# EAGLE design RPi0-HAT1 (EAGLE 9.6.2)
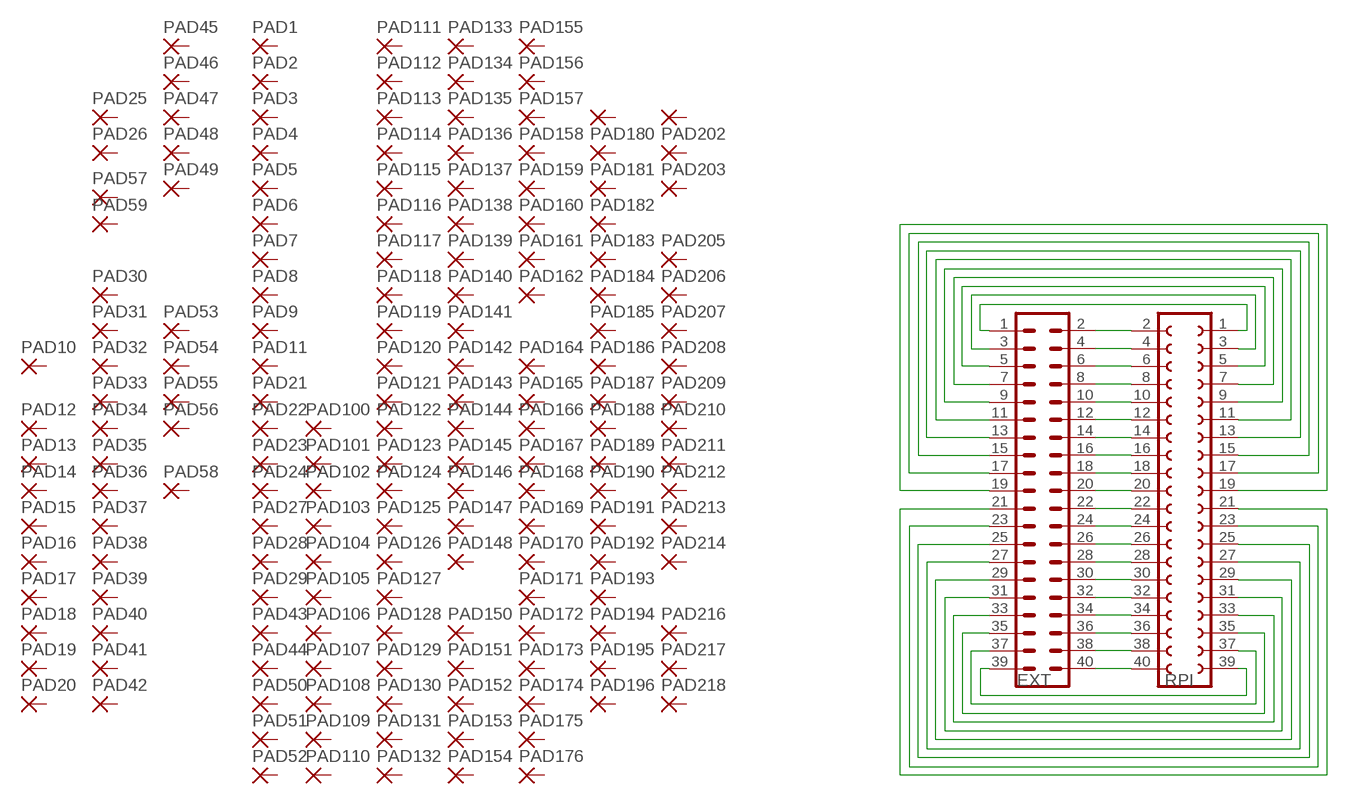
[diagram p0: schematic, sheet 1]

## Parts
EXT  MA20-2  [MA20-2]
PAD1  1,6/0,9  [1,6/0,9]
PAD2  1,6/0,9  [1,6/0,9]
PAD3  1,6/0,9  [1,6/0,9]
PAD4  1,6/0,9  [1,6/0,9]
PAD5  1,6/0,9  [1,6/0,9]
PAD6  1,6/0,9  [1,6/0,9]
PAD7  1,6/0,9  [1,6/0,9]
PAD8  1,6/0,9  [1,6/0,9]
PAD9  1,6/0,9  [1,6/0,9]
PAD10  1,6/0,9  [1,6/0,9]
PAD11  1,6/0,9  [1,6/0,9]
PAD12  1,6/0,9  [1,6/0,9]
PAD13  1,6/0,9  [1,6/0,9]
PAD14  1,6/0,9  [1,6/0,9]
PAD15  1,6/0,9  [1,6/0,9]
PAD16  1,6/0,9  [1,6/0,9]
PAD17  1,6/0,9  [1,6/0,9]
PAD18  1,6/0,9  [1,6/0,9]
PAD19  1,6/0,9  [1,6/0,9]
PAD20  1,6/0,9  [1,6/0,9]
PAD21  1,6/0,9  [1,6/0,9]
PAD22  1,6/0,9  [1,6/0,9]
PAD23  1,6/0,9  [1,6/0,9]
PAD24  1,6/0,9  [1,6/0,9]
PAD25  1,6/0,9  [1,6/0,9]
PAD26  1,6/0,9  [1,6/0,9]
PAD27  1,6/0,9  [1,6/0,9]
PAD28  1,6/0,9  [1,6/0,9]
PAD29  1,6/0,9  [1,6/0,9]
PAD30  1,6/0,9  [1,6/0,9]
PAD31  1,6/0,9  [1,6/0,9]
PAD32  1,6/0,9  [1,6/0,9]
PAD33  1,6/0,9  [1,6/0,9]
PAD34  1,6/0,9  [1,6/0,9]
PAD35  1,6/0,9  [1,6/0,9]
PAD36  1,6/0,9  [1,6/0,9]
PAD37  1,6/0,9  [1,6/0,9]
PAD38  1,6/0,9  [1,6/0,9]
PAD39  1,6/0,9  [1,6/0,9]
PAD40  1,6/0,9  [1,6/0,9]
PAD41  1,6/0,9  [1,6/0,9]
PAD42  1,6/0,9  [1,6/0,9]
PAD43  1,6/0,9  [1,6/0,9]
PAD44  1,6/0,9  [1,6/0,9]
PAD45  1,6/0,9  [1,6/0,9]
PAD46  1,6/0,9  [1,6/0,9]
PAD47  1,6/0,9  [1,6/0,9]
PAD48  1,6/0,9  [1,6/0,9]
PAD49  1,6/0,9  [1,6/0,9]
PAD50  1,6/0,9  [1,6/0,9]
PAD51  1,6/0,9  [1,6/0,9]
PAD52  1,6/0,9  [1,6/0,9]
PAD53  1,6/0,9  [1,6/0,9]
PAD54  1,6/0,9  [1,6/0,9]
PAD55  1,6/0,9  [1,6/0,9]
PAD56  1,6/0,9  [1,6/0,9]
PAD57  1,6/0,9  [1,6/0,9]
PAD58  1,6/0,9  [1,6/0,9]
PAD59  1,6/0,9  [1,6/0,9]
PAD100  1,6/0,9  [1,6/0,9]
PAD101  1,6/0,9  [1,6/0,9]
PAD102  1,6/0,9  [1,6/0,9]
PAD103  1,6/0,9  [1,6/0,9]
PAD104  1,6/0,9  [1,6/0,9]
PAD105  1,6/0,9  [1,6/0,9]
PAD106  1,6/0,9  [1,6/0,9]
PAD107  1,6/0,9  [1,6/0,9]
PAD108  1,6/0,9  [1,6/0,9]
PAD109  1,6/0,9  [1,6/0,9]
PAD110  1,6/0,9  [1,6/0,9]
PAD111  1,6/0,9  [1,6/0,9]
PAD112  1,6/0,9  [1,6/0,9]
PAD113  1,6/0,9  [1,6/0,9]
PAD114  1,6/0,9  [1,6/0,9]
PAD115  1,6/0,9  [1,6/0,9]
PAD116  1,6/0,9  [1,6/0,9]
PAD117  1,6/0,9  [1,6/0,9]
PAD118  1,6/0,9  [1,6/0,9]
PAD119  1,6/0,9  [1,6/0,9]
PAD120  1,6/0,9  [1,6/0,9]
PAD121  1,6/0,9  [1,6/0,9]
PAD122  1,6/0,9  [1,6/0,9]
PAD123  1,6/0,9  [1,6/0,9]
PAD124  1,6/0,9  [1,6/0,9]
PAD125  1,6/0,9  [1,6/0,9]
PAD126  1,6/0,9  [1,6/0,9]
PAD127  1,6/0,9  [1,6/0,9]
PAD128  1,6/0,9  [1,6/0,9]
PAD129  1,6/0,9  [1,6/0,9]
PAD130  1,6/0,9  [1,6/0,9]
PAD131  1,6/0,9  [1,6/0,9]
PAD132  1,6/0,9  [1,6/0,9]
PAD133  1,6/0,9  [1,6/0,9]
PAD134  1,6/0,9  [1,6/0,9]
PAD135  1,6/0,9  [1,6/0,9]
PAD136  1,6/0,9  [1,6/0,9]
PAD137  1,6/0,9  [1,6/0,9]
PAD138  1,6/0,9  [1,6/0,9]
PAD139  1,6/0,9  [1,6/0,9]
PAD140  1,6/0,9  [1,6/0,9]
PAD141  1,6/0,9  [1,6/0,9]
PAD142  1,6/0,9  [1,6/0,9]
PAD143  1,6/0,9  [1,6/0,9]
PAD144  1,6/0,9  [1,6/0,9]
PAD145  1,6/0,9  [1,6/0,9]
PAD146  1,6/0,9  [1,6/0,9]
PAD147  1,6/0,9  [1,6/0,9]
PAD148  1,6/0,9  [1,6/0,9]
PAD150  1,6/0,9  [1,6/0,9]
PAD151  1,6/0,9  [1,6/0,9]
PAD152  1,6/0,9  [1,6/0,9]
PAD153  1,6/0,9  [1,6/0,9]
PAD154  1,6/0,9  [1,6/0,9]
PAD155  1,6/0,9  [1,6/0,9]
PAD156  1,6/0,9  [1,6/0,9]
PAD157  1,6/0,9  [1,6/0,9]
PAD158  1,6/0,9  [1,6/0,9]
PAD159  1,6/0,9  [1,6/0,9]
PAD160  1,6/0,9  [1,6/0,9]
PAD161  1,6/0,9  [1,6/0,9]
PAD162  1,6/0,9  [1,6/0,9]
PAD164  1,6/0,9  [1,6/0,9]
PAD165  1,6/0,9  [1,6/0,9]
PAD166  1,6/0,9  [1,6/0,9]
PAD167  1,6/0,9  [1,6/0,9]
PAD168  1,6/0,9  [1,6/0,9]
PAD169  1,6/0,9  [1,6/0,9]
PAD170  1,6/0,9  [1,6/0,9]
PAD171  1,6/0,9  [1,6/0,9]
PAD172  1,6/0,9  [1,6/0,9]
PAD173  1,6/0,9  [1,6/0,9]
PAD174  1,6/0,9  [1,6/0,9]
PAD175  1,6/0,9  [1,6/0,9]
PAD176  1,6/0,9  [1,6/0,9]
PAD179  1,6/0,9  [1,6/0,9]
PAD180  1,6/0,9  [1,6/0,9]
PAD181  1,6/0,9  [1,6/0,9]
PAD182  1,6/0,9  [1,6/0,9]
PAD183  1,6/0,9  [1,6/0,9]
PAD184  1,6/0,9  [1,6/0,9]
PAD185  1,6/0,9  [1,6/0,9]
PAD186  1,6/0,9  [1,6/0,9]
PAD187  1,6/0,9  [1,6/0,9]
PAD188  1,6/0,9  [1,6/0,9]
PAD189  1,6/0,9  [1,6/0,9]
PAD190  1,6/0,9  [1,6/0,9]
PAD191  1,6/0,9  [1,6/0,9]
PAD192  1,6/0,9  [1,6/0,9]
PAD193  1,6/0,9  [1,6/0,9]
PAD194  1,6/0,9  [1,6/0,9]
PAD195  1,6/0,9  [1,6/0,9]
PAD196  1,6/0,9  [1,6/0,9]
PAD201  1,6/0,9  [1,6/0,9]
PAD202  1,6/0,9  [1,6/0,9]
PAD203  1,6/0,9  [1,6/0,9]
PAD205  1,6/0,9  [1,6/0,9]
PAD206  1,6/0,9  [1,6/0,9]
PAD207  1,6/0,9  [1,6/0,9]
PAD208  1,6/0,9  [1,6/0,9]
PAD209  1,6/0,9  [1,6/0,9]
PAD210  1,6/0,9  [1,6/0,9]
PAD211  1,6/0,9  [1,6/0,9]
PAD212  1,6/0,9  [1,6/0,9]
PAD213  1,6/0,9  [1,6/0,9]
PAD214  1,6/0,9  [1,6/0,9]
PAD216  1,6/0,9  [1,6/0,9]
PAD217  1,6/0,9  [1,6/0,9]
PAD218  1,6/0,9  [1,6/0,9]
RPI  FE20-2  [FE20-2]

## Nets
N$1: EXT.2 RPI.2
N$2: EXT.4 RPI.4
N$3: EXT.6 RPI.6
N$4: EXT.8 RPI.8
N$5: EXT.10 RPI.10
N$6: EXT.12 RPI.12
N$7: EXT.14 RPI.14
N$8: EXT.16 RPI.16
N$9: EXT.18 RPI.18
N$10: EXT.20 RPI.20
N$11: EXT.22 RPI.22
N$12: EXT.24 RPI.24
N$13: EXT.26 RPI.26
N$14: EXT.28 RPI.28
N$15: EXT.30 RPI.30
N$16: EXT.32 RPI.32
N$17: EXT.34 RPI.34
N$18: EXT.36 RPI.36
N$19: EXT.38 RPI.38
N$20: EXT.40 RPI.40
N$21: EXT.1 RPI.1
N$22: EXT.3 RPI.3
N$23: EXT.5 RPI.5
N$24: EXT.7 RPI.7
N$25: EXT.9 RPI.9
N$26: EXT.11 RPI.11
N$27: EXT.13 RPI.13
N$28: EXT.15 RPI.15
N$29: EXT.39 RPI.39
N$30: EXT.37 RPI.37
N$31: EXT.35 RPI.35
N$32: EXT.33 RPI.33
N$33: EXT.31 RPI.31
N$34: EXT.29 RPI.29
N$35: EXT.27 RPI.27
N$36: EXT.25 RPI.25
N$37: EXT.23 RPI.23
N$38: EXT.21 RPI.21
N$39: EXT.19 RPI.19
N$40: EXT.17 RPI.17
Unconnected: PAD1.1(P) PAD2.1(P) PAD3.1(P) PAD4.1(P) PAD5.1(P) PAD6.1(P) PAD7.1(P) PAD8.1(P) PAD9.1(P) PAD10.1(P) PAD11.1(P) PAD12.1(P) PAD13.1(P) PAD14.1(P) PAD15.1(P) PAD16.1(P) PAD17.1(P) PAD18.1(P) PAD19.1(P) PAD20.1(P) PAD21.1(P) PAD22.1(P) PAD23.1(P) PAD24.1(P) PAD25.1(P) PAD26.1(P) PAD27.1(P) PAD28.1(P) PAD29.1(P) PAD30.1(P) PAD31.1(P) PAD32.1(P) PAD33.1(P) PAD34.1(P) PAD35.1(P) PAD36.1(P) PAD37.1(P) PAD38.1(P) PAD39.1(P) PAD40.1(P) PAD41.1(P) PAD42.1(P) PAD43.1(P) PAD44.1(P) PAD45.1(P) PAD46.1(P) PAD47.1(P) PAD48.1(P) PAD49.1(P) PAD50.1(P) PAD51.1(P) PAD52.1(P) PAD53.1(P) PAD54.1(P) PAD55.1(P) PAD56.1(P) PAD57.1(P) PAD58.1(P) PAD59.1(P) PAD100.1(P) PAD101.1(P) PAD102.1(P) PAD103.1(P) PAD104.1(P) PAD105.1(P) PAD106.1(P) PAD107.1(P) PAD108.1(P) PAD109.1(P) PAD110.1(P) PAD111.1(P) PAD112.1(P) PAD113.1(P) PAD114.1(P) PAD115.1(P) PAD116.1(P) PAD117.1(P) PAD118.1(P) PAD119.1(P) PAD120.1(P) PAD121.1(P) PAD122.1(P) PAD123.1(P) PAD124.1(P) PAD125.1(P) PAD126.1(P) PAD127.1(P) PAD128.1(P) PAD129.1(P) PAD130.1(P) PAD131.1(P) PAD132.1(P) PAD133.1(P) PAD134.1(P) PAD135.1(P) PAD136.1(P) PAD137.1(P) PAD138.1(P) PAD139.1(P) PAD140.1(P) PAD141.1(P) PAD142.1(P) PAD143.1(P) PAD144.1(P) PAD145.1(P) PAD146.1(P) PAD147.1(P) PAD148.1(P) PAD150.1(P) PAD151.1(P) PAD152.1(P) PAD153.1(P) PAD154.1(P) PAD155.1(P) PAD156.1(P) PAD157.1(P) PAD158.1(P) PAD159.1(P) PAD160.1(P) PAD161.1(P) PAD162.1(P) PAD164.1(P) PAD165.1(P) PAD166.1(P) PAD167.1(P) PAD168.1(P) PAD169.1(P) PAD170.1(P) PAD171.1(P) PAD172.1(P) PAD173.1(P) PAD174.1(P) PAD175.1(P) PAD176.1(P) PAD179.1(P) PAD180.1(P) PAD181.1(P) PAD182.1(P) PAD183.1(P) PAD184.1(P) PAD185.1(P) PAD186.1(P) PAD187.1(P) PAD188.1(P) PAD189.1(P) PAD190.1(P) PAD191.1(P) PAD192.1(P) PAD193.1(P) PAD194.1(P) PAD195.1(P) PAD196.1(P) PAD201.1(P) PAD202.1(P) PAD203.1(P) PAD205.1(P) PAD206.1(P) PAD207.1(P) PAD208.1(P) PAD209.1(P) PAD210.1(P) PAD211.1(P) PAD212.1(P) PAD213.1(P) PAD214.1(P) PAD216.1(P) PAD217.1(P) PAD218.1(P)

## Library data of the parts
EXT = con-lstb:MA20-2: PIN HEADER; OC_FARNELL: unknown; OC_NEWARK: unknown
PAD1-PAD59 PAD100-PAD148 PAD150-PAD162 PAD164-PAD176 PAD179-PAD196 PAD201-PAD203 PAD205-PAD214 PAD216-PAD218 = wirepad:1,6/0,9: THROUGH-HOLE PAD
RPI = con-lsta:FE20-2: FEMALE HEADER; OC_FARNELL: unknown; OC_NEWARK: unknown

## Board
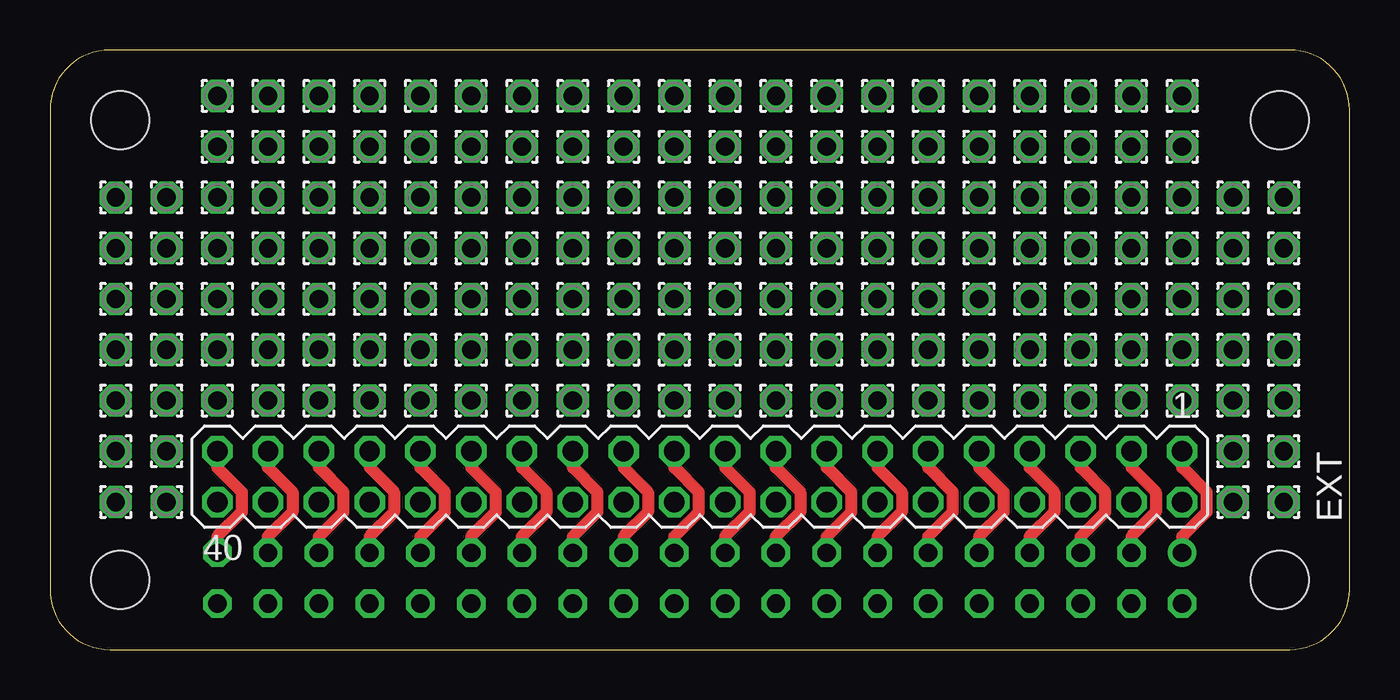
[diagram p1: board, top side]
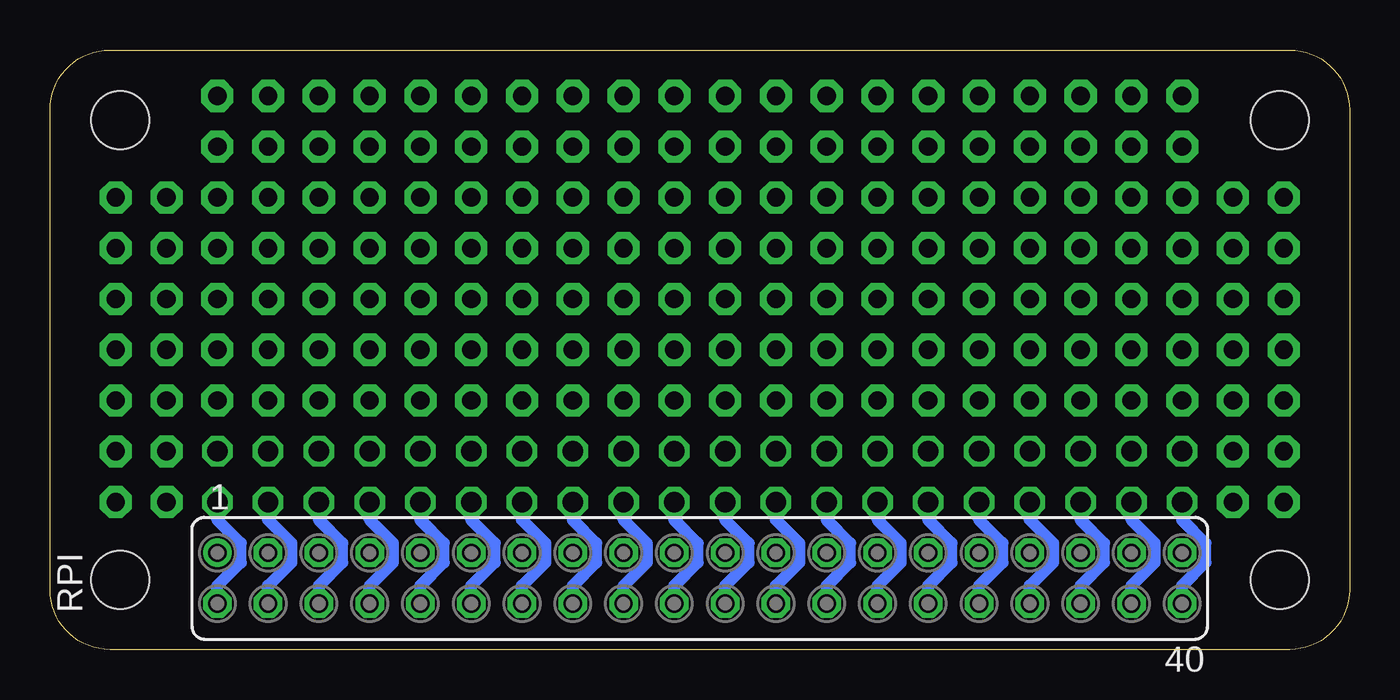
[diagram p2: board, bottom side, seen from below]

Size 65 x 30 mm. Coordinates in mm from the lower left corner, seen from the top.
Outline: 0,27 0,3 arc90 3,0 62,0 arc90 65,3 65,27 arc90 62,30 3,30 arc90 0,27
Copper layers (1*16): Top 0.035mm / dielectric 1.5mm / Bottom 0.035mm
Design rules "SeeedStudio_2layer_DRU_no_angle_20140221": minimum track width 6mil, minimum drill 12mil, track to track 6mil, track to pad 6mil, pad to pad 6mil, via to via 6mil, smd to smd 0mil, copper to edge 10mil, drill to drill 10mil, minimum pad ring 10mil, minimum via ring 6mil, stop-mask expansion 2mil, vias tented up to drill 100mil, thermal gap 10mil
Holes 2.9 mm at 3.5,3.5 61.5,3.5 61.5,26.5 3.5,26.5

### Footprints (pad centres in the part's own frame; a part is rotated, then mirrored left to right if it is on the bottom)
MA20-2 = drill 1.016 octagon: 1 -24.13,-1.27; 2 -24.13,1.27; 3 -21.59,-1.27; 4 -21.59,1.27; 5 -19.05,-1.27; 6 -19.05,1.27; 7 -16.51,-1.27; 8 -16.51,1.27; 9 -13.97,-1.27; 10 -13.97,1.27; 11 -11.43,-1.27; 12 -11.43,1.27; 13 -8.89,-1.27; 14 -8.89,1.27; 15 -6.35,-1.27; 16 -6.35,1.27; 17 -3.81,-1.27; 18 -3.81,1.27; 19 -1.27,-1.27; 20 -1.27,1.27; 21 1.27,-1.27; 22 1.27,1.27; 23 3.81,-1.27; 24 3.81,1.27; 25 6.35,-1.27; 26 6.35,1.27; 27 8.89,-1.27; 28 8.89,1.27; 29 11.43,-1.27; 30 11.43,1.27; 31 13.97,-1.27; 32 13.97,1.27; 33 16.51,-1.27; 34 16.51,1.27; 35 19.05,-1.27; 36 19.05,1.27; 37 21.59,-1.27; 38 21.59,1.27; 39 24.13,-1.27; 40 24.13,1.27
1,6/0,9 = drill 0.914 pad 1.6 octagon: 1 0,0
FE20-2 = drill 0.914: 1 -24.13,1.27 | drill 0.914 octagon: 2 -24.13,-1.27; 3 -21.59,1.27; 4 -21.59,-1.27; 5 -19.05,1.27; 6 -19.05,-1.27; 7 -16.51,1.27; 8 -16.51,-1.27; 9 -13.97,1.27; 10 -13.97,-1.27; 11 -11.43,1.27; 12 -11.43,-1.27; 13 -8.89,1.27; 14 -8.89,-1.27; 15 -6.35,1.27; 16 -6.35,-1.27; 17 -3.81,1.27; 18 -3.81,-1.27; 19 -1.27,1.27; 20 -1.27,-1.27; 21 1.27,1.27; 22 1.27,-1.27; 23 3.81,1.27; 24 3.81,-1.27; 25 6.35,1.27; 26 6.35,-1.27; 27 8.89,1.27; 28 8.89,-1.27; 29 11.43,1.27; 30 11.43,-1.27; 31 13.97,1.27; 32 13.97,-1.27; 33 16.51,1.27; 34 16.51,-1.27; 35 19.05,1.27; 36 19.05,-1.27; 37 21.59,1.27; 38 21.59,-1.27; 39 24.13,1.27; 40 24.13,-1.27

### Placement (x,y rotation side)
EXT  32.5,8.65 180 top
PAD1  15.99,27.7 0 top
PAD2  18.53,27.7 0 top
PAD3  13.45,27.7 0 top
PAD4  10.91,27.7 0 top
PAD5  8.37,27.7 0 top
PAD6  61.71,22.62 0 top
PAD7  59.17,22.62 0 top
PAD8  3.29,22.62 0 top
PAD9  5.83,22.62 0 top
PAD10  33.77,17.54 0 top
PAD11  21.07,27.7 0 top
PAD12  41.39,17.54 0 top
PAD13  26.15,17.54 0 top
PAD14  18.53,17.54 0 top
PAD15  10.91,17.54 0 top
PAD16  3.29,17.54 0 top
PAD17  51.55,20.08 0 top
PAD18  43.93,20.08 0 top
PAD19  36.31,20.08 0 top
PAD20  28.69,20.08 0 top
PAD21  41.39,27.7 0 top
PAD22  46.47,27.7 0 top
PAD23  43.93,27.7 0 top
PAD24  38.85,27.7 0 top
PAD25  18.53,22.62 0 top
PAD26  10.91,22.62 0 top
PAD27  49.01,27.7 0 top
PAD28  51.55,27.7 0 top
PAD29  54.09,27.7 0 top
PAD30  56.63,25.16 0 top
PAD31  10.91,25.16 0 top
PAD32  49.01,22.62 0 top
PAD33  41.39,22.62 0 top
PAD34  33.77,22.62 0 top
PAD35  26.15,22.62 0 top
PAD36  13.45,25.16 0 top
PAD37  8.37,25.16 0 top
PAD38  54.09,25.16 0 top
PAD39  43.93,25.16 0 top
PAD40  46.47,25.16 0 top
PAD41  49.01,25.16 0 top
PAD42  31.23,25.16 0 top
PAD43  56.63,27.7 0 top
PAD44  31.23,27.7 0 top
PAD45  28.69,25.16 0 top
PAD46  26.15,25.16 0 top
PAD47  23.61,25.16 0 top
PAD48  21.07,25.16 0 top
PAD49  18.53,25.16 0 top
PAD50  23.61,27.7 0 top
PAD51  28.69,27.7 0 top
PAD52  26.15,27.7 0 top
PAD53  41.39,25.16 0 top
PAD54  38.85,25.16 0 top
PAD55  36.31,25.16 0 top
PAD56  33.77,25.16 0 top
PAD57  36.31,27.7 0 top
PAD58  51.55,25.16 0 top
PAD59  33.77,27.7 0 top
PAD100  5.83,7.38 0 top
PAD101  59.17,9.92 0 top
PAD102  61.71,9.92 0 top
PAD103  59.17,7.38 0 top
PAD104  61.71,7.38 0 top
PAD105  5.83,9.92 0 top
PAD106  3.29,7.38 0 top
PAD107  3.29,9.92 0 top
PAD108  61.71,12.46 0 top
PAD109  59.17,12.46 0 top
PAD110  8.37,15 0 top
PAD111  15.99,20.08 0 top
PAD112  21.07,15 0 top
PAD113  28.69,15 0 top
PAD114  36.31,15 0 top
PAD115  49.01,17.54 0 top
PAD116  54.09,20.08 0 top
PAD117  46.47,20.08 0 top
PAD118  38.85,20.08 0 top
PAD119  31.23,20.08 0 top
PAD120  56.63,12.46 0 top
PAD121  54.09,12.46 0 top
PAD122  51.55,12.46 0 top
PAD123  49.01,12.46 0 top
PAD124  46.47,12.46 0 top
PAD125  43.93,12.46 0 top
PAD126  41.39,12.46 0 top
PAD127  38.85,12.46 0 top
PAD128  36.31,12.46 0 top
PAD129  33.77,12.46 0 top
PAD130  31.23,12.46 0 top
PAD131  28.69,12.46 0 top
PAD132  26.15,12.46 0 top
PAD133  23.61,12.46 0 top
PAD134  21.07,12.46 0 top
PAD135  18.53,12.46 0 top
PAD136  15.99,12.46 0 top
PAD137  13.45,12.46 0 top
PAD138  10.91,12.46 0 top
PAD139  61.71,15 90 top
PAD140  59.17,15 0 top
PAD141  56.63,15 0 top
PAD142  54.09,15 0 top
PAD143  51.55,15 0 top
PAD144  49.01,15 0 top
PAD145  46.47,15 0 top
PAD146  43.93,15 0 top
PAD147  3.29,12.46 0 top
PAD148  5.83,12.46 0 top
PAD150  8.37,12.46 0 top
PAD151  61.71,17.54 0 top
PAD152  54.09,17.54 0 top
PAD153  46.47,17.54 0 top
PAD154  38.85,17.54 0 top
PAD155  31.23,17.54 0 top
PAD156  23.61,17.54 0 top
PAD157  15.99,17.54 0 top
PAD158  8.37,17.54 0 top
PAD159  26.15,15 0 top
PAD160  18.53,15 0 top
PAD161  10.91,15 0 top
PAD162  3.29,15 0 top
PAD164  54.09,22.62 0 top
PAD165  46.47,22.62 0 top
PAD166  38.85,22.62 0 top
PAD167  31.23,22.62 0 top
PAD168  23.61,22.62 0 top
PAD169  15.99,22.62 0 top
PAD170  8.37,22.62 0 top
PAD171  26.15,20.08 0 top
PAD172  18.53,20.08 0 top
PAD173  10.91,20.08 0 top
PAD174  3.29,20.08 0 top
PAD175  41.39,15 0 top
PAD176  33.77,15 0 top
PAD179  13.45,15 0 top
PAD180  5.83,15 0 top
PAD181  59.17,17.54 0 top
PAD182  51.55,17.54 0 top
PAD183  43.93,17.54 0 top
PAD184  36.31,17.54 0 top
PAD185  28.69,17.54 0 top
PAD186  21.07,17.54 0 top
PAD187  13.45,17.54 0 top
PAD188  5.83,17.54 0 top
PAD189  41.39,20.08 0 top
PAD190  33.77,20.08 0 top
PAD191  13.45,20.08 0 top
PAD192  5.83,20.08 0 top
PAD193  15.99,25.16 0 top
PAD194  51.55,22.62 0 top
PAD195  43.93,22.62 0 top
PAD196  36.31,22.62 0 top
PAD201  28.69,22.62 0 top
PAD202  21.07,22.62 0 top
PAD203  13.45,22.62 0 top
PAD205  56.63,20.08 0 top
PAD206  59.17,20.08 0 top
PAD207  38.85,15 0 top
PAD208  31.23,15 0 top
PAD209  23.61,15 0 top
PAD210  15.99,15 0 top
PAD211  23.61,20.08 0 top
PAD212  49.01,20.08 0 top
PAD213  61.71,20.08 0 top
PAD214  56.63,22.62 0 top
PAD216  21.07,20.08 0 top
PAD217  8.37,20.08 0 top
PAD218  56.63,17.54 0 top
RPI  32.5,3.57 0 bottom

### Tracks (layer width: path | path; a pad name or v marks a point on that pad's centre or on a via)
N$1
  Bottom 0.61: RPI.2 56.63,3.19 55.46,4.36 55.46,5.32 56.63,6.49 EXT.2
N$2
  Bottom 0.61: RPI.4 54.09,3.19 52.92,4.36 52.92,5.32 54.09,6.49 EXT.4
N$3
  Bottom 0.61: RPI.6 51.55,3.19 50.38,4.36 50.38,5.32 51.55,6.49 EXT.6
N$4
  Bottom 0.61: RPI.8 49.01,3.19 47.84,4.36 47.84,5.32 49.01,6.49 EXT.8
N$5
  Bottom 0.61: RPI.10 46.47,3.19 45.3,4.36 45.3,5.32 46.47,6.49 EXT.10
N$6
  Bottom 0.61: RPI.12 43.93,3.19 42.76,4.36 42.76,5.32 43.93,6.49 EXT.12
N$7
  Bottom 0.61: RPI.14 41.39,3.19 40.22,4.36 40.22,5.32 41.39,6.49 EXT.14
N$8
  Bottom 0.61: RPI.16 38.85,3.19 37.68,4.36 37.68,5.32 38.85,6.49 EXT.16
N$9
  Bottom 0.61: RPI.18 36.31,3.19 35.14,4.36 35.14,5.32 36.31,6.49 EXT.18
N$10
  Bottom 0.61: RPI.20 33.77,3.19 32.6,4.36 32.6,5.32 33.77,6.49 EXT.20
N$11
  Bottom 0.61: RPI.22 31.23,3.19 30.06,4.36 30.06,5.32 31.23,6.49 EXT.22
N$12
  Bottom 0.61: RPI.24 28.69,3.19 27.52,4.36 27.52,5.32 28.69,6.49 EXT.24
N$13
  Bottom 0.61: RPI.26 26.15,3.19 24.98,4.36 24.98,5.32 26.15,6.49 EXT.26
N$14
  Bottom 0.61: RPI.28 23.61,3.19 22.44,4.36 22.44,5.32 23.61,6.49 EXT.28
N$15
  Bottom 0.61: RPI.30 21.07,3.19 19.9,4.36 19.9,5.32 21.07,6.49 EXT.30
N$16
  Bottom 0.61: RPI.32 18.53,3.19 17.36,4.36 17.36,5.32 18.53,6.49 EXT.32
N$17
  Bottom 0.61: RPI.34 15.99,3.19 14.82,4.36 14.82,5.32 15.99,6.49 EXT.34
N$18
  Bottom 0.61: RPI.36 13.45,3.19 12.28,4.36 12.28,5.32 13.45,6.49 EXT.36
N$19
  Bottom 0.61: RPI.38 10.91,3.19 9.74,4.36 9.74,5.32 10.91,6.49 EXT.38
N$20
  Bottom 0.61: RPI.40 8.37,3.19 7.2,4.36 7.2,5.32 8.37,6.49 EXT.40
N$21
  Top 0.61: EXT.1 56.63,9.1 57.85,7.88 57.85,6.88 56.63,5.66 RPI.1
N$22
  Top 0.61: EXT.3 54.09,9.1 55.31,7.88 55.31,6.88 54.09,5.66 RPI.3
N$23
  Top 0.61: EXT.5 51.55,9.1 52.77,7.88 52.77,6.88 51.55,5.66 RPI.5
N$24
  Top 0.61: EXT.7 49.01,9.1 50.23,7.88 50.23,6.88 49.01,5.66 RPI.7
N$25
  Top 0.61: EXT.9 46.47,9.1 47.69,7.88 47.69,6.88 46.47,5.66 RPI.9
N$26
  Top 0.61: EXT.11 43.93,9.1 45.15,7.88 45.15,6.88 43.93,5.66 RPI.11
N$27
  Top 0.61: EXT.13 41.39,9.1 42.61,7.88 42.61,6.88 41.39,5.66 RPI.13
N$28
  Top 0.61: EXT.15 38.85,9.1 40.07,7.88 40.07,6.88 38.85,5.66 RPI.15
N$29
  Top 0.61: EXT.39 8.37,9.1 9.59,7.88 9.59,6.88 8.37,5.66 RPI.39
N$30
  Top 0.61: EXT.37 10.91,9.1 12.13,7.88 12.13,6.88 10.91,5.66 RPI.37
N$31
  Top 0.61: EXT.35 13.45,9.1 14.67,7.88 14.67,6.88 13.45,5.66 RPI.35
N$32
  Top 0.61: EXT.33 15.99,9.1 17.21,7.88 17.21,6.88 15.99,5.66 RPI.33
N$33
  Top 0.61: EXT.31 18.53,9.1 19.75,7.88 19.75,6.88 18.53,5.66 RPI.31
N$34
  Top 0.61: EXT.29 21.07,9.1 22.29,7.88 22.29,6.88 21.07,5.66 RPI.29
N$35
  Top 0.61: EXT.27 23.61,9.1 24.83,7.88 24.83,6.88 23.61,5.66 RPI.27
N$36
  Top 0.61: EXT.25 26.15,9.1 27.37,7.88 27.37,6.88 26.15,5.66 RPI.25
N$37
  Top 0.61: EXT.23 28.69,9.1 29.91,7.88 29.91,6.88 28.69,5.66 RPI.23
N$38
  Top 0.61: EXT.21 31.23,9.1 32.45,7.88 32.45,6.88 31.23,5.66 RPI.21
N$39
  Top 0.61: EXT.19 33.77,9.1 34.99,7.88 34.99,6.88 33.77,5.66 RPI.19
N$40
  Top 0.61: EXT.17 36.31,9.1 37.53,7.88 37.53,6.88 36.31,5.66 RPI.17